# EAGLE design MODISLIM (EAGLE 6.4)
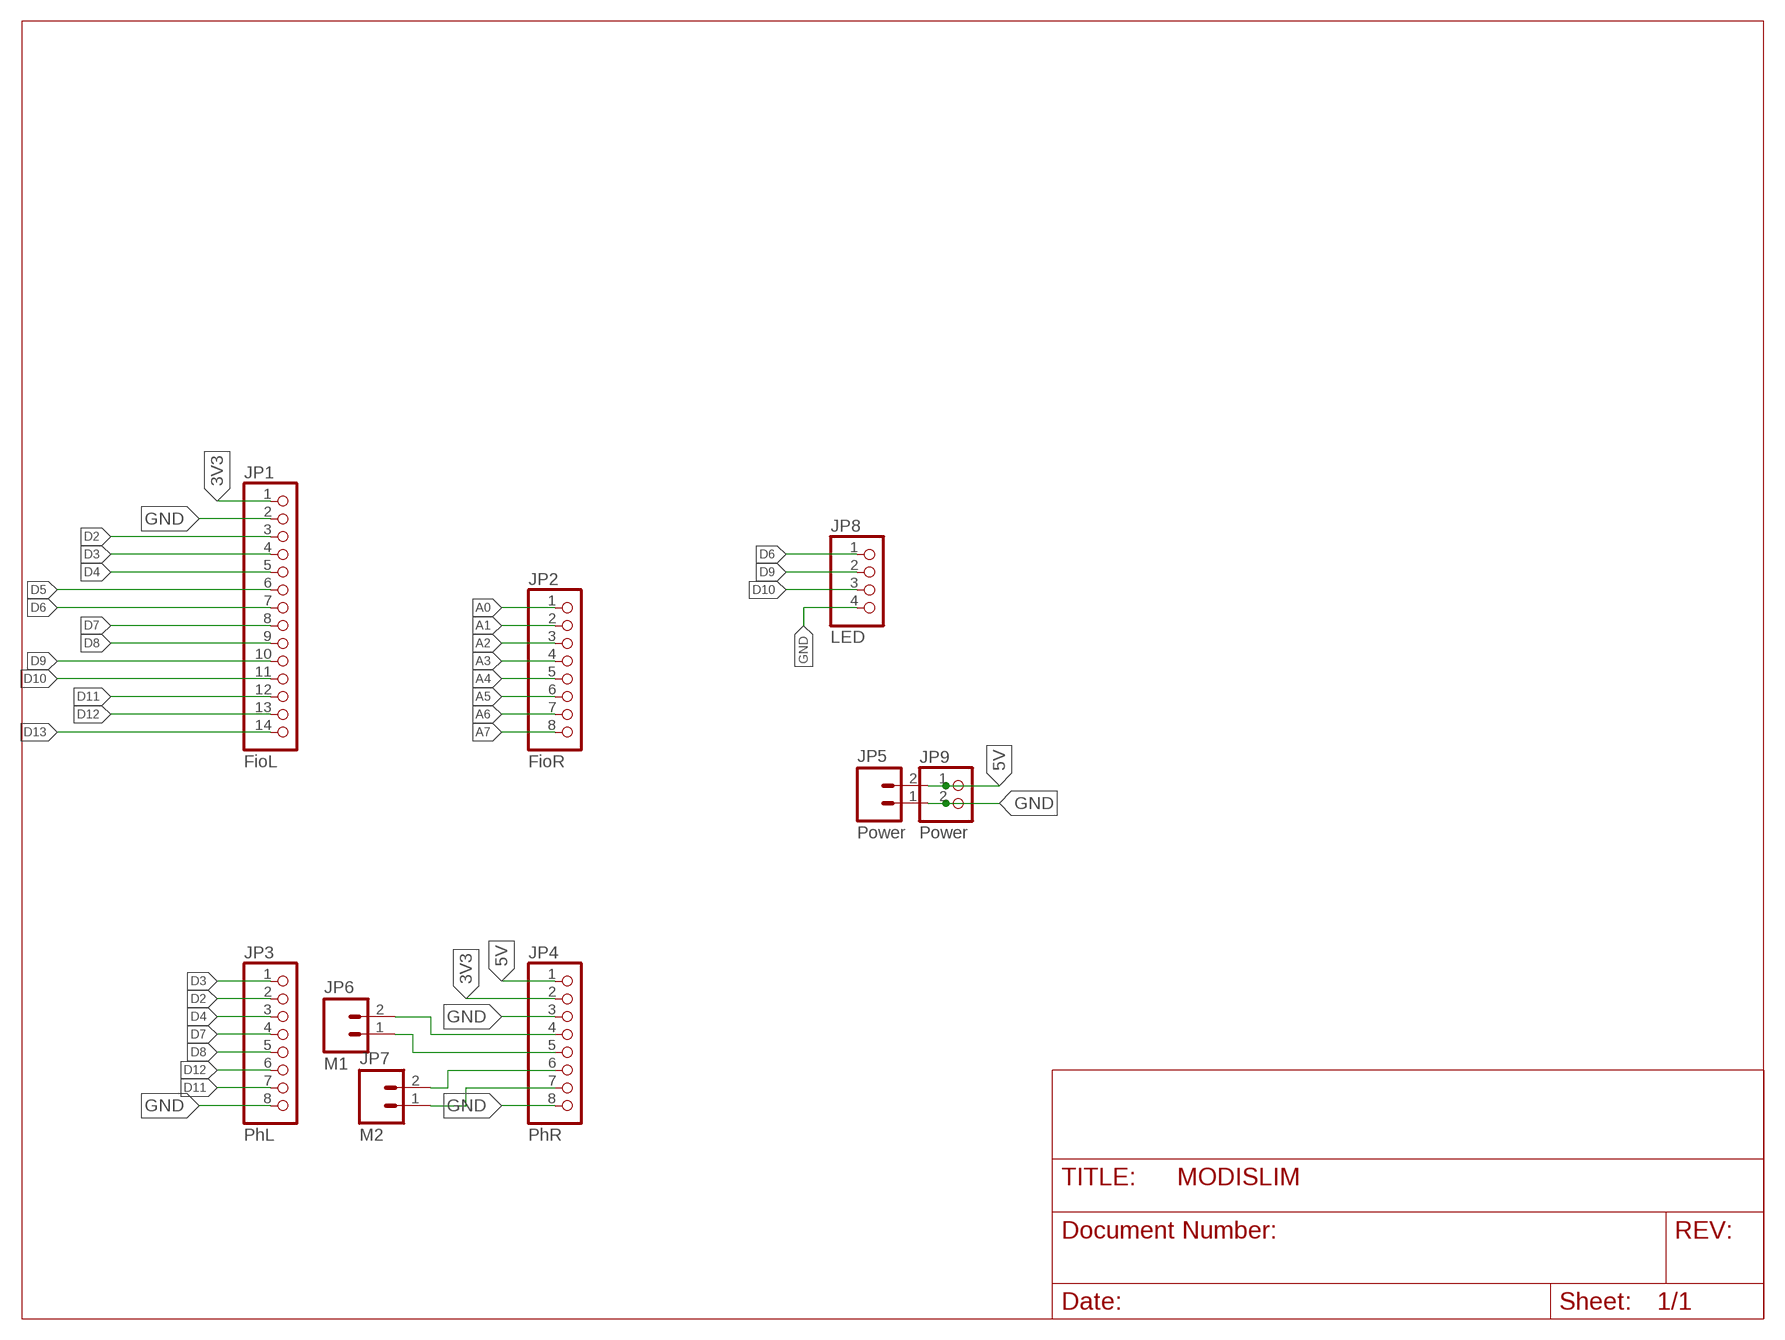
[diagram p0: schematic, sheet 1]

## Parts
JP1  FioL  PINHD-1X14  [1X14]
JP2  FioR  PINHD-1X8  [1X08]
JP3  PhL  PINHD-1X8  [1X08]
JP4  PhR  PINHD-1X8  [1X08]
JP5  Power  M023.5MM  [SCREWTERMINAL-3.5MM-2]
JP6  M1  M023.5MM  [SCREWTERMINAL-3.5MM-2]
JP7  M2  M023.5MM  [SCREWTERMINAL-3.5MM-2]
JP8  LED  PINHD-1X4  [1X04]
JP9  Power  PINHD-1X2  [1X02]

## Nets
3V3: JP1.1 JP4.2
5V: JP4.1 JP5.2 JP9.1
A0: JP2.1
A1: JP2.2
A2: JP2.3
A3: JP2.4
A4: JP2.5
A5: JP2.6
A6: JP2.7
A7: JP2.8
D2: JP1.3 JP3.2
D3: JP1.4 JP3.1
D4: JP1.5 JP3.3
D5: JP1.6
D6: JP1.7 JP8.1
D7: JP1.8 JP3.4
D8: JP1.9 JP3.5
D9: JP1.10 JP8.2
D10: JP1.11 JP8.3
D11: JP1.12 JP3.7
D12: JP1.13 JP3.6
D13: JP1.14
GND: JP1.2 JP3.8 JP4.3 JP4.8 JP5.1 JP8.4 JP9.2
N$1: JP4.7 JP7.1
N$2: JP4.6 JP7.2
N$3: JP4.5 JP6.1
N$4: JP4.4 JP6.2

## Library data of the parts
JP1 = pinhead:PINHD-1X14: PIN HEADER
JP2-JP4 = pinhead:PINHD-1X8: PIN HEADER
JP5-JP7 = SparkFun:M02: Header 2 Standard 2-pin 0.1" header. Use with straight break away headers (SKU : PRT-00116), right angle break away headers (PRT-00553), swiss pins (PRT-00743), machine pins (PRT-00117), and female headers (PRT-00115). Molex polarized connector foot print use with SKU : PRT-08233 with associated crimp pins and housings.
JP8 = pinhead:PINHD-1X4: PIN HEADER
JP9 = pinhead:PINHD-1X2: PIN HEADER

## Board
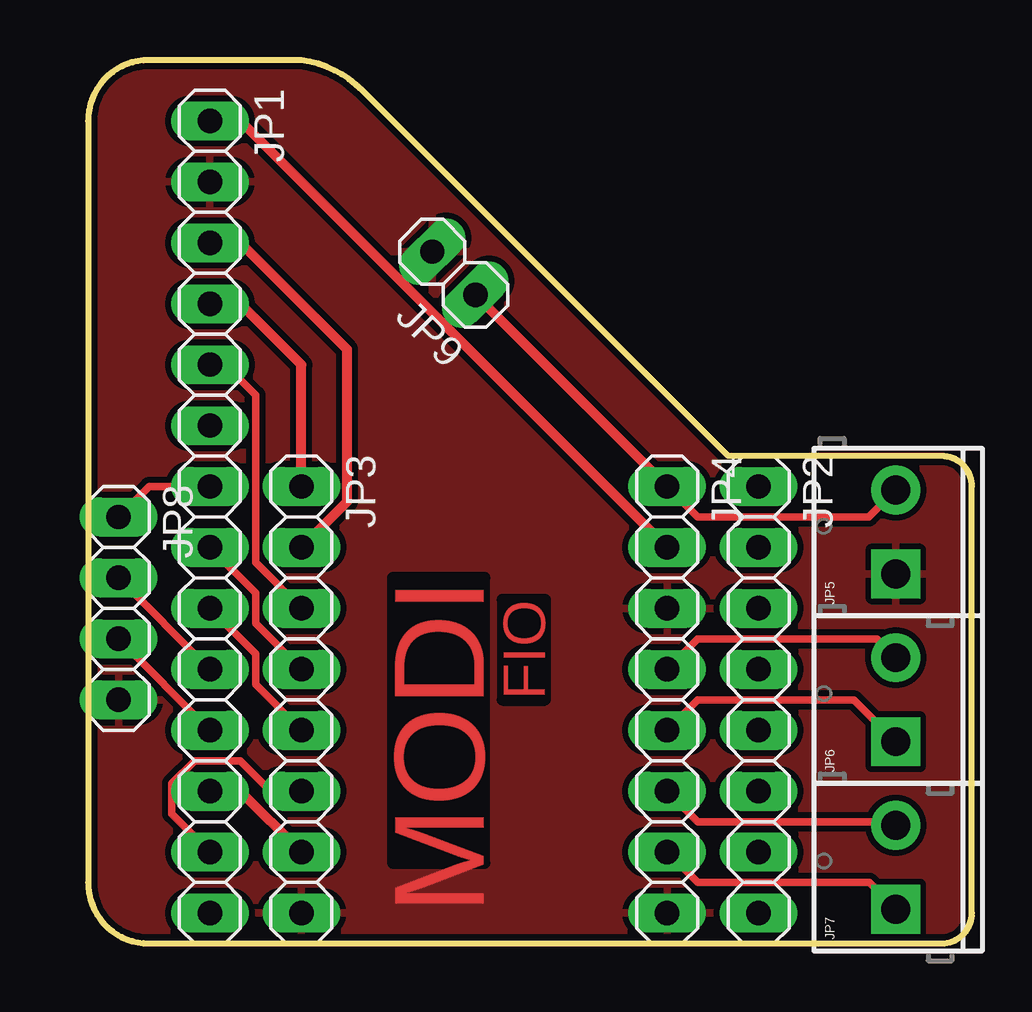
[diagram p1: board, top side]

Size 36.83 x 36.83 mm. Coordinates in mm from the lower left corner, seen from the top.
Outline: 0,2.54 arc90 2.54,0 35.56,0 arc90 36.83,1.27 36.83,19.05 arc90 35.56,20.32 26.67,20.32 11.43,35.56 arc37 8.89,36.83 2.54,36.83 arc90 0,34.29 0,2.54
Copper layers (1*16): Top 0.035mm / dielectric 1.5mm / Bottom 0.035mm
Design rules "HL-CFE-CIGA_diciembre2011": minimum track width 10mil, minimum drill 0.7mm, track to track 10mil, track to pad 10mil, pad to pad 10mil, via to via 10mil, smd to smd 10mil, copper to edge 10mil, drill to drill 10mil, minimum pad ring 10mil, minimum via ring 8mil, stop-mask expansion 4mil, vias tented up to drill 25mil, thermal gap 10mil

### Footprints (pad centres in the part's own frame; a part is rotated, then mirrored left to right if it is on the bottom)
1X14 = drill 1.016 long: 1 -16.51,0; 2 -13.97,0; 3 -11.43,0; 4 -8.89,0; 5 -6.35,0; 6 -3.81,0; 7 -1.27,0; 8 1.27,0; 9 3.81,0; 10 6.35,0; 11 8.89,0; 12 11.43,0; 13 13.97,0; 14 16.51,0
1X08 = drill 1.016 long: 1 -8.89,0; 2 -6.35,0; 3 -3.81,0; 4 -1.27,0; 5 1.27,0; 6 3.81,0; 7 6.35,0; 8 8.89,0
SCREWTERMINAL-3.5MM-2 = drill 1.2 pad 2.032 square: 1 0,0 | drill 1.2 pad 2.032: 2 3.5,0
1X04 = drill 1.016 long: 1 -3.81,0; 2 -1.27,0; 3 1.27,0; 4 3.81,0
1X02 = drill 1.016 long: 1 -1.27,0; 2 1.27,0

### Placement (x,y rotation side)
JP1  5.08,17.78 270 top
JP2  27.94,10.16 270 top
JP3  8.89,10.16 270 top
JP4  24.13,10.16 270 top
JP5  33.66,15.4 90 top
JP6  33.66,8.41 90 top
JP7  33.66,1.43 90 top
JP8  1.27,13.97 270 top
JP9  15.24,27.94 135 top

### Tracks (layer width: path | path; a pad name or v marks a point on that pad's centre or on a via)
3V3
  Top 0.406: JP4.2 6.35,34.29 JP1.1
5V
  Top 0.305: JP4.1 25.4,17.78 32.54,17.78 JP5.2
  Top 0.406: JP4.1 | JP9.1 JP4.1
D2
  Top 0.406: JP1.3 6.35,29.21 10.79,24.77 10.79,18.41 JP3.2
D3
  Top 0.406: JP3.1 8.89,24.13 6.35,26.67 JP1.4
D4
  Top 0.305: 5.71,24.13 6.99,22.86 6.99,15.88 JP3.3
  Top 0.406: 5.71,24.13 JP1.5
D6
  Top 0.305: JP1.7 2.54,19.05 JP8.1
D7
  Top 0.305: JP3.4 6.99,13.34 6.99,14.61 JP1.8
D8
  Top 0.305: JP3.5 6.99,10.79 6.99,12.06 JP1.9
D9
  Top 0.305: JP8.2 JP1.10
D10
  Top 0.305: JP8.3 JP1.11
D11
  Top 0.406: JP1.12 6.35,6.35 JP3.7
D12
  Top 0.305: 7.62,6.35 6.35,7.62 4.45,7.62 3.49,6.67 3.49,5.4 JP1.13
  Top 0.406: 7.62,6.35 JP3.6
GND
  pour Top: 0,39.37 7.62,39.37 26.67,20.32 36.51,20.32 36.51,0 0,0
N$1
  Top 0.305: JP4.7 25.4,2.54 32.54,2.54 JP7.1
N$2
  Top 0.305: JP4.6 25.4,5.08 33.5,5.08
  Top 0.406: 33.5,5.08 JP7.2
N$3
  Top 0.305: JP4.5 25.4,10.16 31.91,10.16 JP6.1
N$4
  Top 0.305: JP4.4 25.4,12.7 32.87,12.7 JP6.2

### Text on the board
Top: MODI | FIO